# Altium schematic sheet sensor.SchDoc
size A4
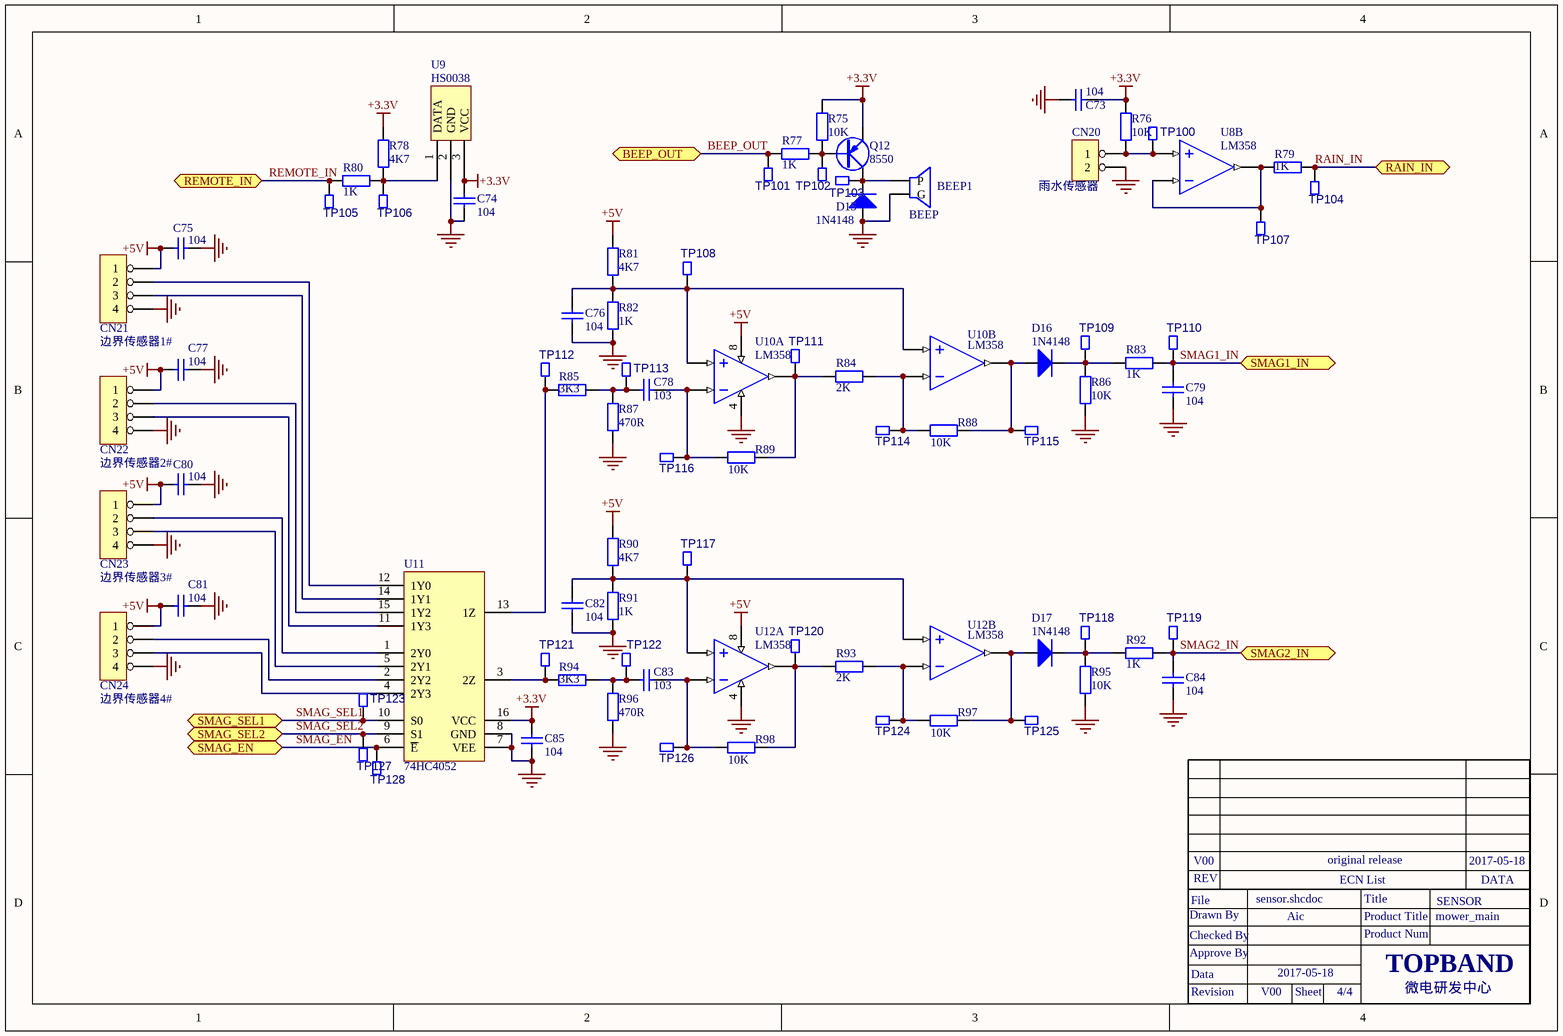
[diagram p0: sensor.SchDoc]

## Parts
BEEP1  BEEP  [BELL-5]
C73  104  [0603C]
C74  104  [0603C]
C75  104  [0603C]
C76  104  [0603C]
C77  104  [0603C]
C78  103  [0603C]
C79  104  [0603C]
C80  104  [0603C]
C81  104  [0603C]
C82  104  [0603C]
C83  103  [0603C]
C84  104  [0603C]
C85  104  [0603C]
CN20  雨水传感器  [CON2-2.54]
CN21  边界传感器1#  [CON4-2.54]
CN22  边界传感器2#  [CON4-2.54]
CN23  边界传感器3#  [CON4-2.54]
CN24  边界传感器4#  [CON4-2.54]
D15  1N4148  [SOD-123]
D16  1N4148  [SOD-123]
D17  1N4148  [SOD-123]
Q12  8550  [SOT-23-BCE]
R75  10K  [0603R]
R76  10K  [0603R]
R77  1K  [0603R]
R78  4K7  [0603R]
R79  1K  [0603R]
R80  1K  [0603R]
R81  4K7  [0603R]
R82  1K  [0603R]
R83  1K  [0603R]
R84  2K  [0603R]
R85  3K3  [0603R]
R86  10K  [0603R]
R87  470R  [0603R]
R88  10K  [0603R]
R89  10K  [0603R]
R90  4K7  [0603R]
R91  1K  [0603R]
R92  1K  [0603R]
R93  2K  [0603R]
R94  3K3  [0603R]
R95  10K  [0603R]
R96  470R  [0603R]
R97  10K  [0603R]
R98  10K  [0603R]
TP100  TP  [TEST-0.8MM]  (value not drawn)
TP101  TP  [TEST-0.8MM]  (value not drawn)
TP102  TP  [TEST-0.8MM]  (value not drawn)
TP103  TP  [TEST-0.8MM]  (value not drawn)
TP104  TP  [TEST-0.8MM]  (value not drawn)
TP105  TP  [TEST-0.8MM]  (value not drawn)
TP106  TP  [TEST-0.8MM]  (value not drawn)
TP107  TP  [TEST-0.8MM]  (value not drawn)
TP108  TP  [TEST-0.8MM]  (value not drawn)
TP109  TP  [TEST-0.8MM]  (value not drawn)
TP110  TP  [TEST-0.8MM]  (value not drawn)
TP111  TP  [TEST-0.8MM]  (value not drawn)
TP112  TP  [TEST-0.8MM]  (value not drawn)
TP113  TP  [TEST-0.8MM]  (value not drawn)
TP114  TP  [TEST-0.8MM]  (value not drawn)
TP115  TP  [TEST-0.8MM]  (value not drawn)
TP116  TP  [TEST-0.8MM]  (value not drawn)
TP117  TP  [TEST-0.8MM]  (value not drawn)
TP118  TP  [TEST-0.8MM]  (value not drawn)
TP119  TP  [TEST-0.8MM]  (value not drawn)
TP120  TP  [TEST-0.8MM]  (value not drawn)
TP121  TP  [TEST-0.8MM]  (value not drawn)
TP122  TP  [TEST-0.8MM]  (value not drawn)
TP123  TP  [TEST-0.8MM]  (value not drawn)
TP124  TP  [TEST-0.8MM]  (value not drawn)
TP125  TP  [TEST-0.8MM]  (value not drawn)
TP126  TP  [TEST-0.8MM]  (value not drawn)
TP127  TP  [TEST-0.8MM]  (value not drawn)
TP128  TP  [TEST-0.8MM]  (value not drawn)
U8  LM358  [SO-8]  (part B of 2)
U9  HS0038  [HS0038]
U10  LM358  [SO-8]  (parts A,B of 2)
U11  74HC4052  [SO-16]
U12  LM358  [SO-8]  (parts A,B of 2)

## Ports
BEEP_OUT, RAIN_IN, REMOTE_IN, SMAG1_IN, SMAG2_IN, SMAG_EN, SMAG_SEL1, SMAG_SEL2

## Nets
+3.3V: C73.1 C74.2 C85.1 Q12.E R75.2 R76.2 R78.2 U9.3(VCC) U11.16(VCC)
+5V: C75.2 C77.2 C80.2 C81.2 CN21.1 CN22.1 CN23.1 CN24.1 R81.2 R90.2 U10.8(VCC) U12.8(VCC)
GND: BEEP1.2(G) C73.2 C74.1 C75.1 C76.2 C77.1 C79.2 C80.1 C81.1 C82.2 C84.2 C85.2 CN20.2 CN21.4 CN22.4 CN23.4 CN24.4 D15.A R82.1 R86.2 R87.1 R91.1 R95.2 R96.1 U9.2(GND) U10.4(GND) U11.7(VEE) U11.8(GND) U12.4(GND)
BEEP_OUT: R77.1 TP101.1 ; port BEEP_OUT
RAIN_IN: R79.2 TP104.1 ; port RAIN_IN
REMOTE_IN: R80.1 TP105.1 ; port REMOTE_IN
SMAG1_IN: C79.1 R83.2 TP110.1 ; port SMAG1_IN
SMAG2_IN: C84.1 R92.2 TP119.1 ; port SMAG2_IN
SMAG_EN: TP128.1 U11.6(~{E}) ; port SMAG_EN
SMAG_SEL1: TP123.1 U11.10(S0) ; port SMAG_SEL1
SMAG_SEL2: TP127.1 U11.9(S1) ; port SMAG_SEL2
NetBEEP1_1: BEEP1.1(P) D15.K Q12.C TP103.1
NetC76_1: C76.1 R81.1 R82.2 TP108.1 U10.3(IN2+) U10.5(+IN1)
NetC78_1: C78.1 R89.2 TP116.1 U10.6(-IN1)
NetC78_2: C78.2 R85.2 R87.2 TP113.1
NetC82_1: C82.1 R90.1 R91.2 TP117.1 U12.3(IN2+) U12.5(+IN1)
NetC83_1: C83.1 R98.2 TP126.1 U12.6(-IN1)
NetC83_2: C83.2 R94.2 R96.2 TP122.1
NetCN20_1: CN20.1 R76.1 TP100.1 U8.3(IN2+)
NetCN21_2: CN21.2 U11.12(1Y0)
NetCN21_3: CN21.3 U11.14(1Y1)
NetCN22_2: CN22.2 U11.15(1Y2)
NetCN22_3: CN22.3 U11.11(1Y3)
NetCN23_2: CN23.2 U11.1(2Y0)
NetCN23_3: CN23.3 U11.5(2Y1)
NetCN24_2: CN24.2 U11.2(2Y2)
NetCN24_3: CN24.3 U11.4(2Y3)
NetD16_A: D16.A R88.1 TP115.1 U10.1(OUT2)
NetD16_K: D16.K R83.1 R86.1 TP109.1
NetD17_A: D17.A R97.1 TP125.1 U12.1(OUT2)
NetD17_K: D17.K R92.1 R95.1 TP118.1
NetQ12_B: Q12.B R75.1 R77.2 TP102.1
NetR78_1: R78.1 R80.2 TP106.1 U9.1(DATA)
NetR79_1: R79.1 TP107.1 U8.1(OUT2) U8.2(-IN2)
NetR84_1: R84.1 R88.2 TP114.1 U10.2(-IN2)
NetR84_2: R84.2 R89.1 TP111.1 U10.7(OUT1)
NetR85_1: R85.1 TP112.1 U11.13(1Z)
NetR93_1: R93.1 R97.2 TP124.1 U12.2(-IN2)
NetR93_2: R93.2 R98.1 TP120.1 U12.7(OUT1)
NetR94_1: R94.1 TP121.1 U11.3(2Z)

## Notes on the sheet
- Drawn By
- File
- REV
- V00
- sensor.shcdoc
- Aic
- original release
- ECN List
- Product Title
- Title
- mower_main
- SENSOR
- 2017-05-18
- DATA
- Approve By
- Checked By
- Data
- Product Num
- TOPBAND
- Revision
- Sheet
- 4/4
- 微电研发中心

## Library data of the parts
C73-C85 = Cap(0603): Component Kind: standard; Component Type: standard
CN20 = 2Pin(卧式): 插座; U_TABLE: U_SAM01021601; id: 20; Part Number: 2Pin(卧式); Component Kind: Standard; Component Type: Standard; Designator: 2Pin(卧式); Footprint: CON2-2.54卧式; Pin Count: 2
CN21-CN24 = 4Pin(2~3.96mm): 插座; U_TABLE: U_SAM01021601; id: 28; Part Number: 4Pin(2~3.96mm); Component Kind: Standard; Component Type: Standard; Designator: 4Pin(2~3.96mm); Footprint: CON4-2.0; Pin Count: 4
D15-D17 = Diode(DO-35)-D: 二极管; U_TABLE: U_SAM010203; id: 32; Part Number: Diode(DO-35)-D; Component Kind: standard; Component Type: standard; Pin Count: 2
Q12 = PNP(贴片): 三极管; U_TABLE: U_SAM010204; id: 20; Part Number: PNP(贴片); Component Kind: standard; Component Type: standard; Pin Count: 3
R75-R78 R80 = Res(0603): 120100221; U_TABLE: U_SAM010201; id: 106; Description: 电阻器; U_ITEM_ID（物料编码）: 120101813; U_100114（SAP物料描述）: SMT电阻RR0603_1502_F_1/16W_50V_国巨_; U_100012（标称值-文本）: 1502; U_100116（标称值-浮点）: 15; U_100013（单位）: KΩ; U_100083（允许偏差）: F; U_100029（额定功率）: 1/16W; U_100040（封装方式）: RR0603; U_100049（极限电压）: 50V; U_100047（环保属性）: 环保; U_100107（工厂BOM使用频率）: 2000:8;; U_100105（工厂库存）: 1200:0.000;2000:3965.000;3000:0.000;; U_100117（工厂采购量）: 2000:5000.000;; Part Number: Res(0603); Component Kind: standard; Component Type: standard; U_100086（指定供应商）: 国巨
R79 = Res(0603): 120101780; U_TABLE: U_SAM010201; id: 106; Description: 电阻器; U_ITEM_ID（物料编码）: 120101577; U_100114（SAP物料描述）: SMT电阻RR0603_104_J_1/10W_50V_环保; U_100012（标称值-文本）: 104; U_100116（标称值-浮点）: 100; U_100013（单位）: KΩ; U_100083（允许偏差）: J; U_100029（额定功率）: 1/10W; U_100040（封装方式）: RR0603; U_100049（极限电压）: 50V; U_100047（环保属性）: 环保; U_100107（工厂BOM使用频率）: 1000:11;1500:1;2000:22;4000:24;5000:18;; U_100105（工厂库存）: 1000:6199.000;1200:0.000;1300:0.000;1500:3629.000;2000:599.000;3000:0.000;4000:3400.000;5000:26880; U_100117（工厂采购量）: 1000:160000.000;1500:5000.000;2000:5000.000;5000:105000.000;; Part Number: Res(0603); Component Kind: standard; Component Type: standard
R81 R84-R90 R93-R98 = Res2: Resistor; Value: 1K; Published: 8-Jun-2000; LatestRevisionDate: 17-Jul-2002; LatestRevisionNote: Re-released for DXP Platform.; PackageReference: AXIAL-0.4; Publisher: Altium Limited
R82 R83 R91 R92 = Res2: Resistor; Published: 8-Jun-2000; LatestRevisionDate: 17-Jul-2002; LatestRevisionNote: Re-released for DXP Platform.; PackageReference: AXIAL-0.4; Publisher: Altium Limited; Value: 1K
U8 U10 U12 = IC_LM358: 121000225; U_TABLE: U_SAM010210; Description: 集成电路; id: 83; U_ITEM_ID（物料编码）: 121000100; U_100114（SAP物料描述）: SMT运放LM358_SO-8_TI_环保; U_100047（环保属性）: 环保; U_100107（工厂BOM使用频率）: 1000:1;1500:12;3000:7;5000:14;; U_100105（工厂库存）: 1000:7508.000;1500:160.000;2000:0.000;3000:485.000;5000:1542.000;; U_100117（工厂采购量）: 1000:7500.000;1500:300.000;3000:2500.000;5000:7500.000;; Part Number: IC_LM358; Component Kind: standard; Component Type: standard; Designator: IC_LM358; Footprint: DIP14; Pin Count: 8; U_100076（型号）: LM358; U_100040（封装方式）: SO-8; U_100086（指定供应商）: TI